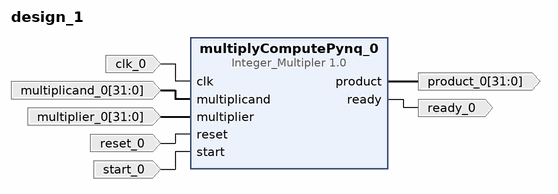
[diagram p0: block diagram of the top level]
# Vivado block design design_1, xc7z020clg400-1, Vivado 2020.1
create_bd_design design_1

create_bd_port -dir I -type clk clk_0
create_bd_port -dir I -from 31 -to 0 multiplicand_0
create_bd_port -dir I -from 31 -to 0 multiplier_0
create_bd_port -dir O -from 31 -to 0 product_0
create_bd_port -dir O ready_0
create_bd_port -dir I -type rst reset_0
create_bd_port -dir I start_0

create_bd_cell -type ip -vlnv xilinx.com:user:Integer_Multipler:1.0 multiplyComputePynq_0

# ---- connections ----

connect_bd_net -net clk_0_1 [get_bd_ports clk_0] [get_bd_pins multiplyComputePynq_0/clk]
connect_bd_net -net multiplicand_0_1 [get_bd_ports multiplicand_0] [get_bd_pins multiplyComputePynq_0/multiplicand]
connect_bd_net -net multiplier_0_1 [get_bd_ports multiplier_0] [get_bd_pins multiplyComputePynq_0/multiplier]
connect_bd_net [get_bd_pins multiplyComputePynq_0/product] [get_bd_ports product_0]
connect_bd_net [get_bd_pins multiplyComputePynq_0/ready] [get_bd_ports ready_0]
connect_bd_net -net reset_0_1 [get_bd_ports reset_0] [get_bd_pins multiplyComputePynq_0/reset]
connect_bd_net -net start_0_1 [get_bd_ports start_0] [get_bd_pins multiplyComputePynq_0/start]

validate_bd_design
save_bd_design
